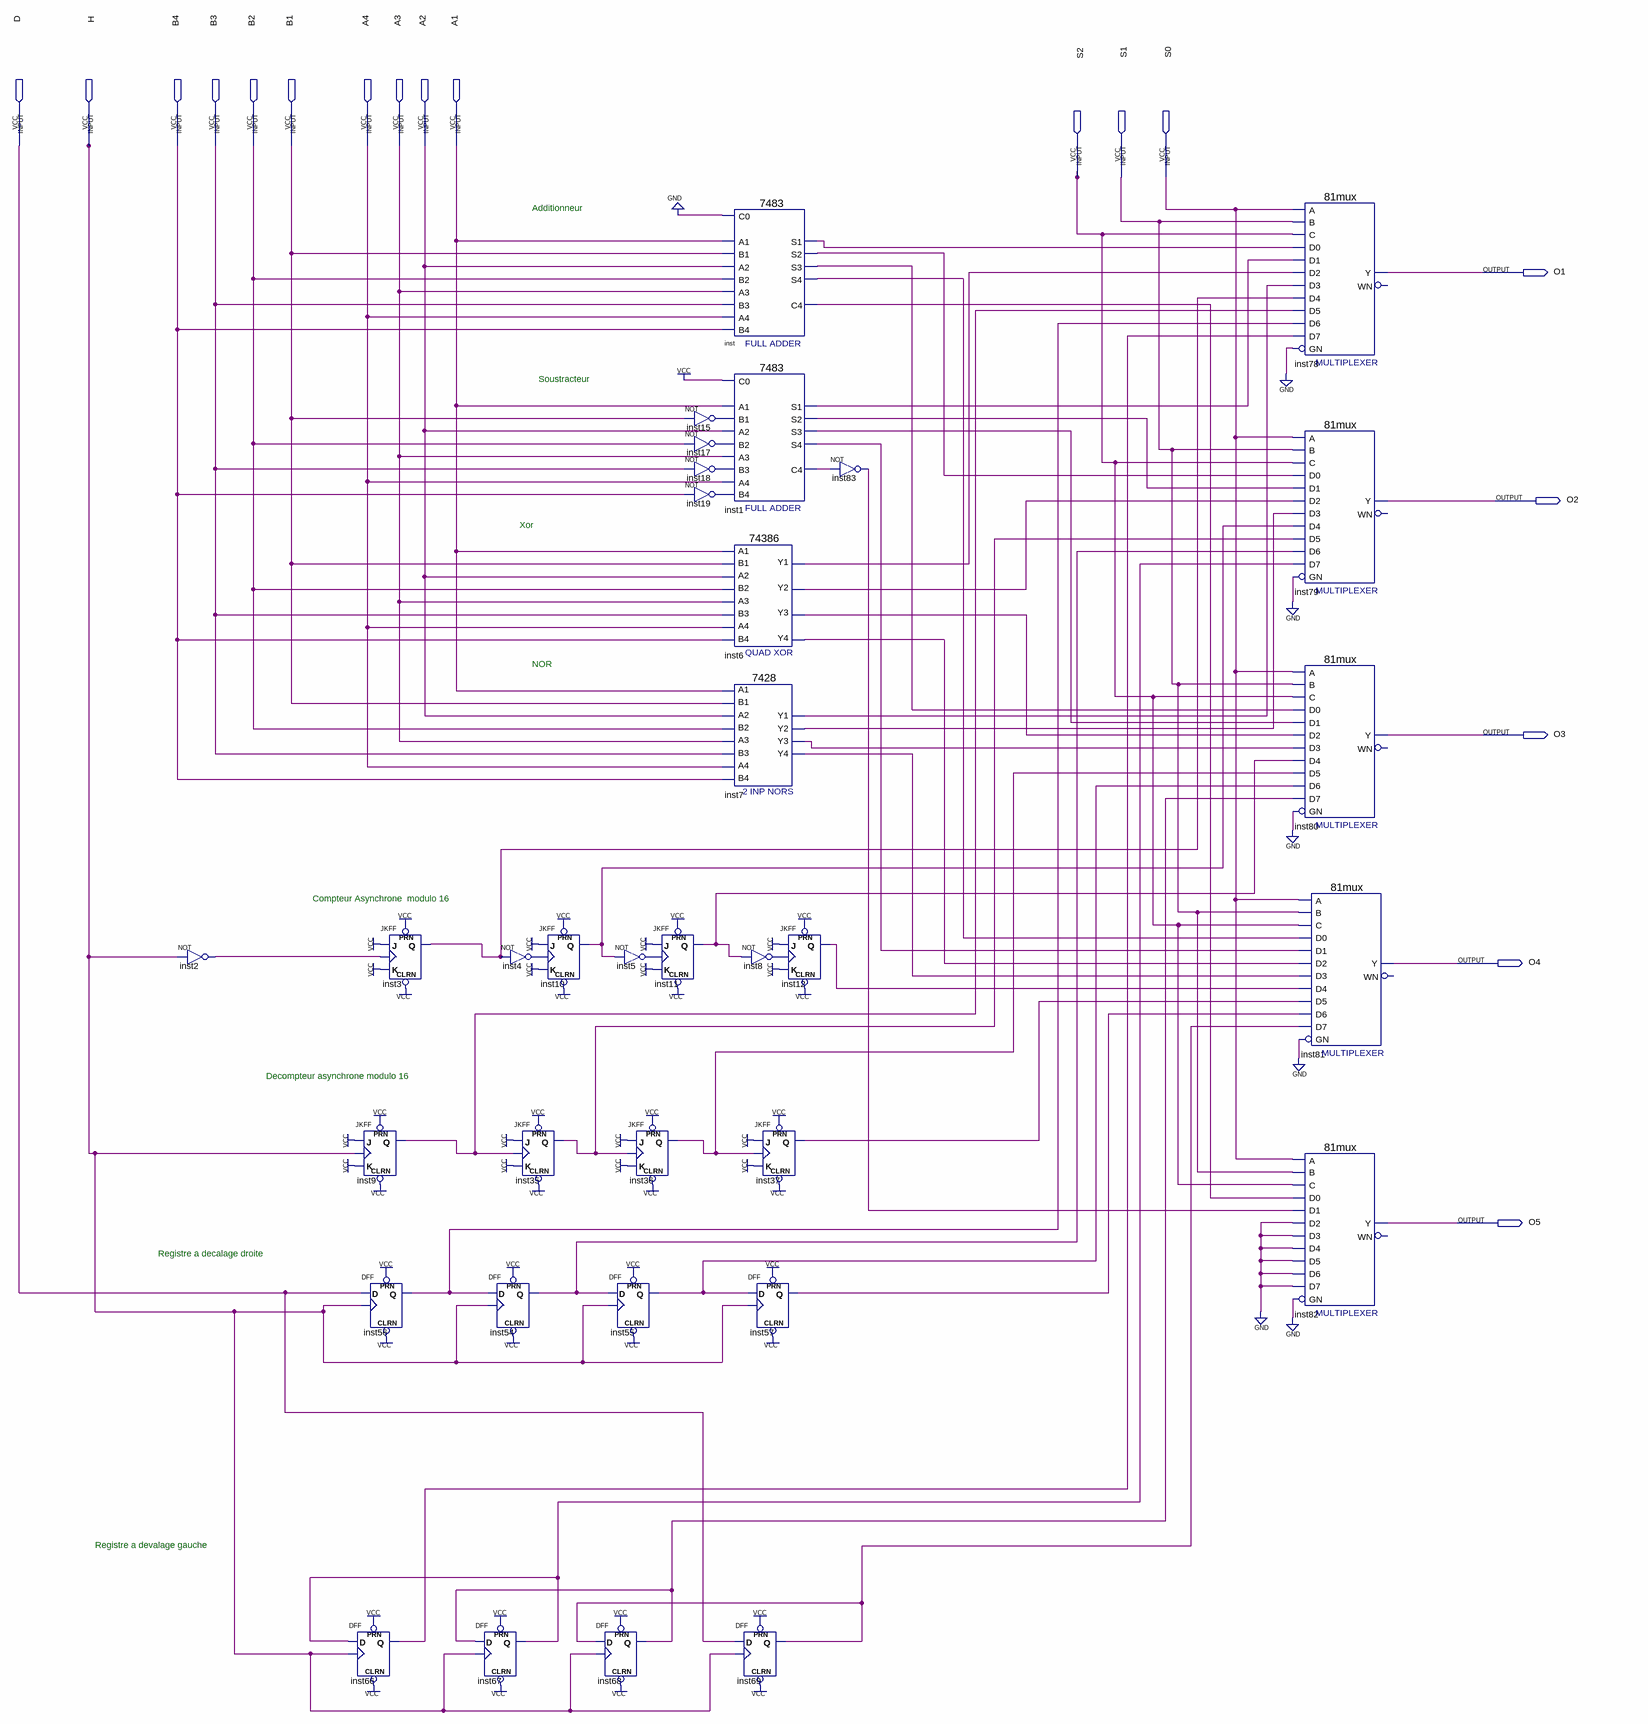
[diagram p0: schematic sheet]
// Quartus schematic UAL_complet.bdf as structural Verilog: 34 symbols, 18 pins
module UAL_complet (
  input  D,
  input  H,
  input  B4,
  input  B3,
  input  B2,
  input  B1,
  input  A4,
  input  A3,
  input  A2,
  input  A1,
  input  S2,
  input  S1,
  input  S0,
  output O1,
  output O2,
  output O3,
  output O4,
  output O5
);

  wire inst1_c4, inst1_s1, inst1_s2, inst1_s3, inst1_s4, inst2_out, inst3_q, inst4_out, inst5_out, inst6_y1,
       inst6_y2, inst6_y3, inst6_y4, inst7_y1, inst7_y2, inst7_y3, inst7_y4, inst8_out, inst9_q, inst10_q,
       inst11_q, inst12_q, inst15_out, inst17_out, inst18_out, inst19_out, inst35_q, inst36_q, inst37_q,
       inst54_q, inst55_q, inst56_q, inst57_q, inst66_q, inst67_q, inst68_q, inst69_q, inst83_out, inst_c4,
       inst_s1, inst_s2, inst_s3, inst_s4;

  not inst2 (inst2_out, H);
  JKFF inst9 (.PRN(1'b1), .CLRN(1'b1), .K(1'b1), .J(1'b1), .CLK(H), .Q(inst9_q));
  DFF inst56 (.CLRN(1'b1), .CLK(H), .D(D), .PRN(1'b1), .Q(inst56_q));
  DFF inst66 (.CLRN(1'b1), .CLK(H), .D(inst67_q), .PRN(1'b1), .Q(inst66_q));
  JKFF inst3 (.PRN(1'b1), .CLRN(1'b1), .K(1'b1), .J(1'b1), .CLK(inst2_out), .Q(inst3_q));
  not inst4 (inst4_out, inst3_q);
  JKFF inst35 (.PRN(1'b1), .CLRN(1'b1), .K(1'b1), .J(1'b1), .CLK(inst9_q), .Q(inst35_q));
  DFF inst54 (.CLRN(1'b1), .CLK(H), .D(inst56_q), .PRN(1'b1), .Q(inst54_q));
  DFF inst67 (.CLRN(1'b1), .CLK(H), .D(inst68_q), .PRN(1'b1), .Q(inst67_q));
  JKFF inst10 (.PRN(1'b1), .CLRN(1'b1), .K(1'b1), .J(1'b1), .CLK(inst4_out), .Q(inst10_q));
  not inst5 (inst5_out, inst10_q);
  DFF inst55 (.CLRN(1'b1), .CLK(H), .D(inst54_q), .PRN(1'b1), .Q(inst55_q));
  DFF inst68 (.CLRN(1'b1), .CLK(H), .D(inst69_q), .PRN(1'b1), .Q(inst68_q));
  JKFF inst11 (.PRN(1'b1), .CLRN(1'b1), .K(1'b1), .J(1'b1), .CLK(inst5_out), .Q(inst11_q));
  JKFF inst36 (.PRN(1'b1), .CLRN(1'b1), .K(1'b1), .J(1'b1), .CLK(inst35_q), .Q(inst36_q));
  \7483  inst (
    .B4(B4), .C0(1'b0), .A1(A1), .A2(A2), .B1(B1), .B2(B2), .A3(A3), .B3(B3), .A4(A4), .S3(inst_s3),
    .S4(inst_s4), .S2(inst_s2), .C4(inst_c4), .S1(inst_s1));
  \7483  inst1 (
    .B4(inst19_out), .C0(1'b1), .A1(A1), .A2(A2), .B1(inst15_out), .B2(inst17_out), .A3(A3), .B3(inst18_out),
    .A4(A4), .S3(inst1_s3), .S4(inst1_s4), .S2(inst1_s2), .C4(inst1_c4), .S1(inst1_s1));
  not inst15 (inst15_out, B1);
  not inst17 (inst17_out, B2);
  not inst18 (inst18_out, B3);
  not inst19 (inst19_out, B4);
  \74386  inst6 (
    .B1(B1), .B2(B2), .A2(A2), .A3(A3), .B3(B3), .A4(A4), .A1(A1), .B4(B4), .Y2(inst6_y2), .Y1(inst6_y1),
    .Y4(inst6_y4), .Y3(inst6_y3));
  \7428  inst7 (
    .B2(B2), .A2(A2), .B1(B1), .B4(B4), .A4(A4), .B3(B3), .A1(A1), .A3(A3), .Y2(inst7_y2), .Y3(inst7_y3),
    .Y4(inst7_y4), .Y1(inst7_y1));
  not inst8 (inst8_out, inst11_q);
  JKFF inst37 (.PRN(1'b1), .CLRN(1'b1), .K(1'b1), .J(1'b1), .CLK(inst36_q), .Q(inst37_q));
  DFF inst57 (.CLRN(1'b1), .CLK(H), .D(inst55_q), .PRN(1'b1), .Q(inst57_q));
  DFF inst69 (.CLRN(1'b1), .CLK(H), .D(D), .PRN(1'b1), .Q(inst69_q));
  JKFF inst12 (.PRN(1'b1), .CLRN(1'b1), .K(1'b1), .J(1'b1), .CLK(inst8_out), .Q(inst12_q));
  not inst83 (inst83_out, inst1_c4);
  \81mux  inst78 (
    .C(S2), .D1(inst1_s1), .D0(inst_s1), .D5(inst9_q), .D4(inst3_q), .D2(inst6_y1), .D3(inst7_y1), .GN(1'b0),
    .D7(inst66_q), .D6(inst56_q), .A(S0), .B(S1), .Y(O1));  // open: WN
  \81mux  inst79 (
    .C(S2), .D1(inst1_s2), .D0(inst_s2), .D5(inst35_q), .D4(inst10_q), .D2(inst6_y2), .D3(inst7_y2),
    .GN(1'b0), .D7(inst67_q), .D6(inst54_q), .A(S0), .B(S1), .Y(O2));  // open: WN
  \81mux  inst80 (
    .C(S2), .D1(inst1_s3), .D0(inst_s3), .D5(inst36_q), .D4(inst11_q), .D2(inst6_y3), .D3(inst7_y3),
    .GN(1'b0), .D7(inst68_q), .D6(inst55_q), .A(S0), .B(S1), .Y(O3));  // open: WN
  \81mux  inst81 (
    .C(S2), .D1(inst1_s4), .D0(inst_s4), .D5(inst37_q), .D4(inst12_q), .D2(inst6_y4), .D3(inst7_y4),
    .GN(1'b0), .D7(inst69_q), .D6(inst57_q), .A(S0), .B(S1), .Y(O4));  // open: WN
  \81mux  inst82 (
    .C(S2), .D1(inst83_out), .D0(inst_c4), .D5(1'b0), .D4(1'b0), .D2(1'b0), .D3(1'b0), .GN(1'b0), .D7(1'b0),
    .D6(1'b0), .A(S0), .B(S1), .Y(O5));  // open: WN

  // Notes on the sheet:
  //   Additionneur
  //   Soustracteur
  //   Xor
  //   NOR
  //    Compteur Asynchrone  modulo 16
  //   Decompteur asynchrone modulo 16
  //   Registre a decalage droite 
  //   Registre a devalage gauche 
endmodule
